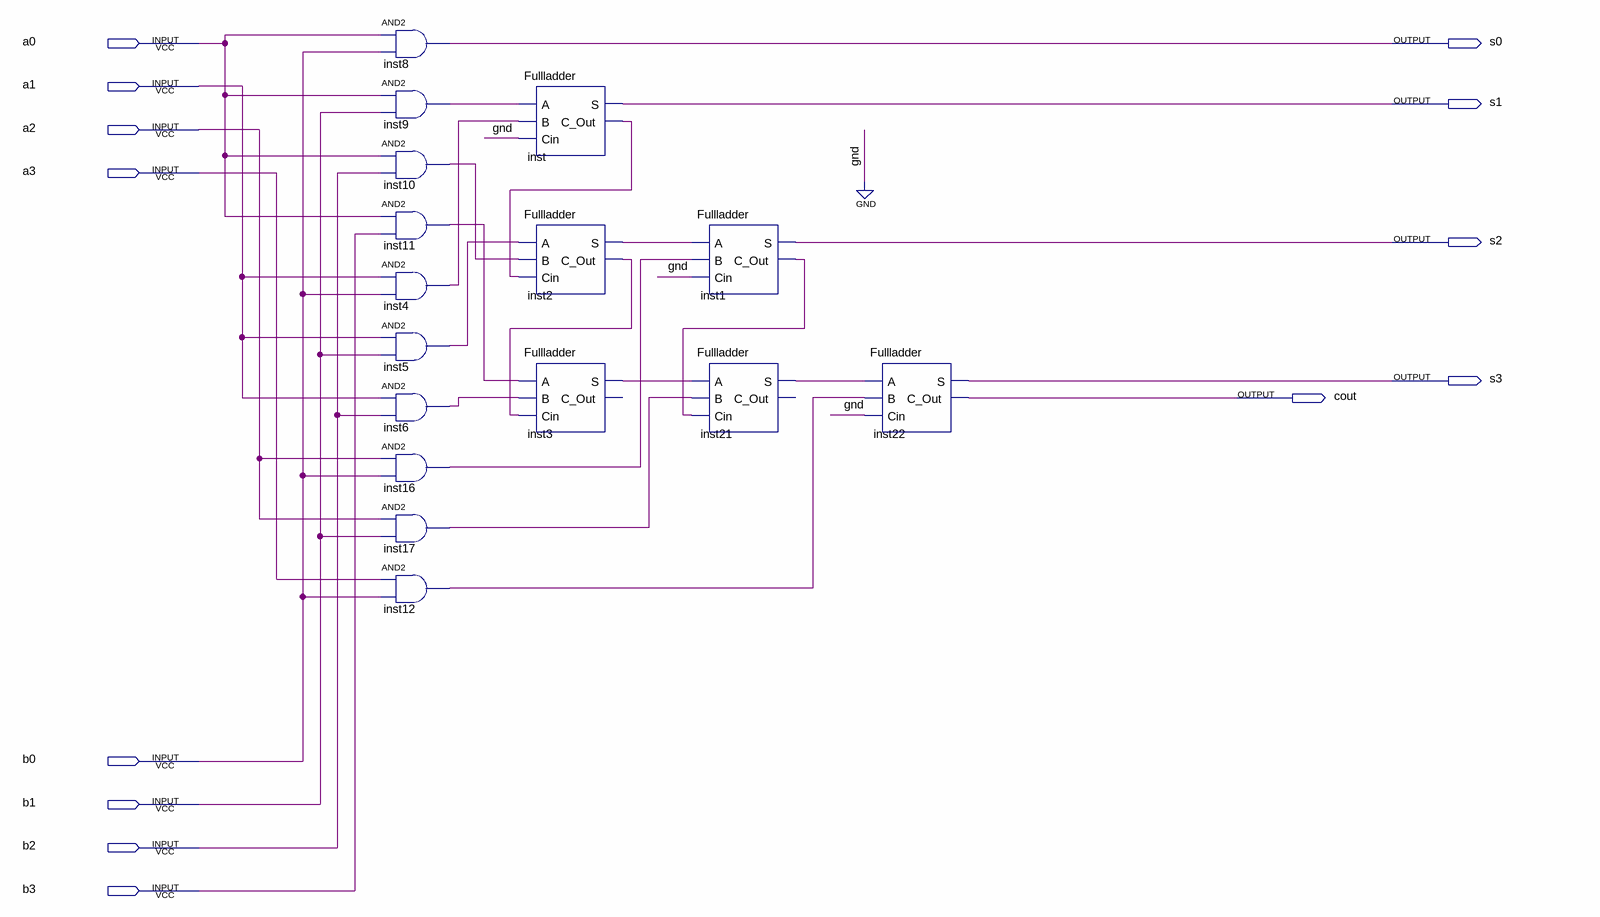
[diagram p0: schematic sheet]
// Quartus schematic multi.bdf as structural Verilog: 16 symbols, 13 pins
module multi (
  input  a0,
  input  a1,
  input  a2,
  input  a3,
  input  b0,
  input  b1,
  input  b2,
  input  b3,
  output s0,
  output s1,
  output s2,
  output s3,
  output cout
);

  wire inst1_c_out, inst2_c_out, inst2_s, inst3_s, inst4_out, inst5_out, inst6_out, inst9_out, inst10_out,
       inst11_out, inst12_out, inst16_out, inst17_out, inst21_s, inst_c_out;

  and inst8 (s0, a0, b0);
  and inst9 (inst9_out, a0, b1);
  and inst10 (inst10_out, a0, b2);
  and inst11 (inst11_out, a0, b3);
  and inst4 (inst4_out, a1, b0);
  and inst5 (inst5_out, a1, b1);
  and inst6 (inst6_out, a1, b2);
  and inst16 (inst16_out, a2, b0);
  and inst17 (inst17_out, a2, b1);
  and inst12 (inst12_out, a3, b0);
  Fullladder inst (.A(inst9_out), .B(inst4_out), .Cin(1'b0), .S(s1), .C_Out(inst_c_out));
  Fullladder inst2 (.A(inst5_out), .B(inst10_out), .Cin(inst_c_out), .S(inst2_s), .C_Out(inst2_c_out));
  Fullladder inst3 (.A(inst11_out), .B(inst6_out), .Cin(inst2_c_out), .S(inst3_s));  // open: C_Out
  Fullladder inst1 (.A(inst2_s), .B(inst16_out), .Cin(1'b0), .S(s2), .C_Out(inst1_c_out));
  Fullladder inst21 (.A(inst3_s), .B(inst17_out), .Cin(inst1_c_out), .S(inst21_s));  // open: C_Out
  Fullladder inst22 (.A(inst21_s), .B(inst12_out), .Cin(1'b0), .S(s3), .C_Out(cout));
endmodule
